# EAGLE design TSOC_Block_Template_Dual_SMD (EAGLE 6.6.0)
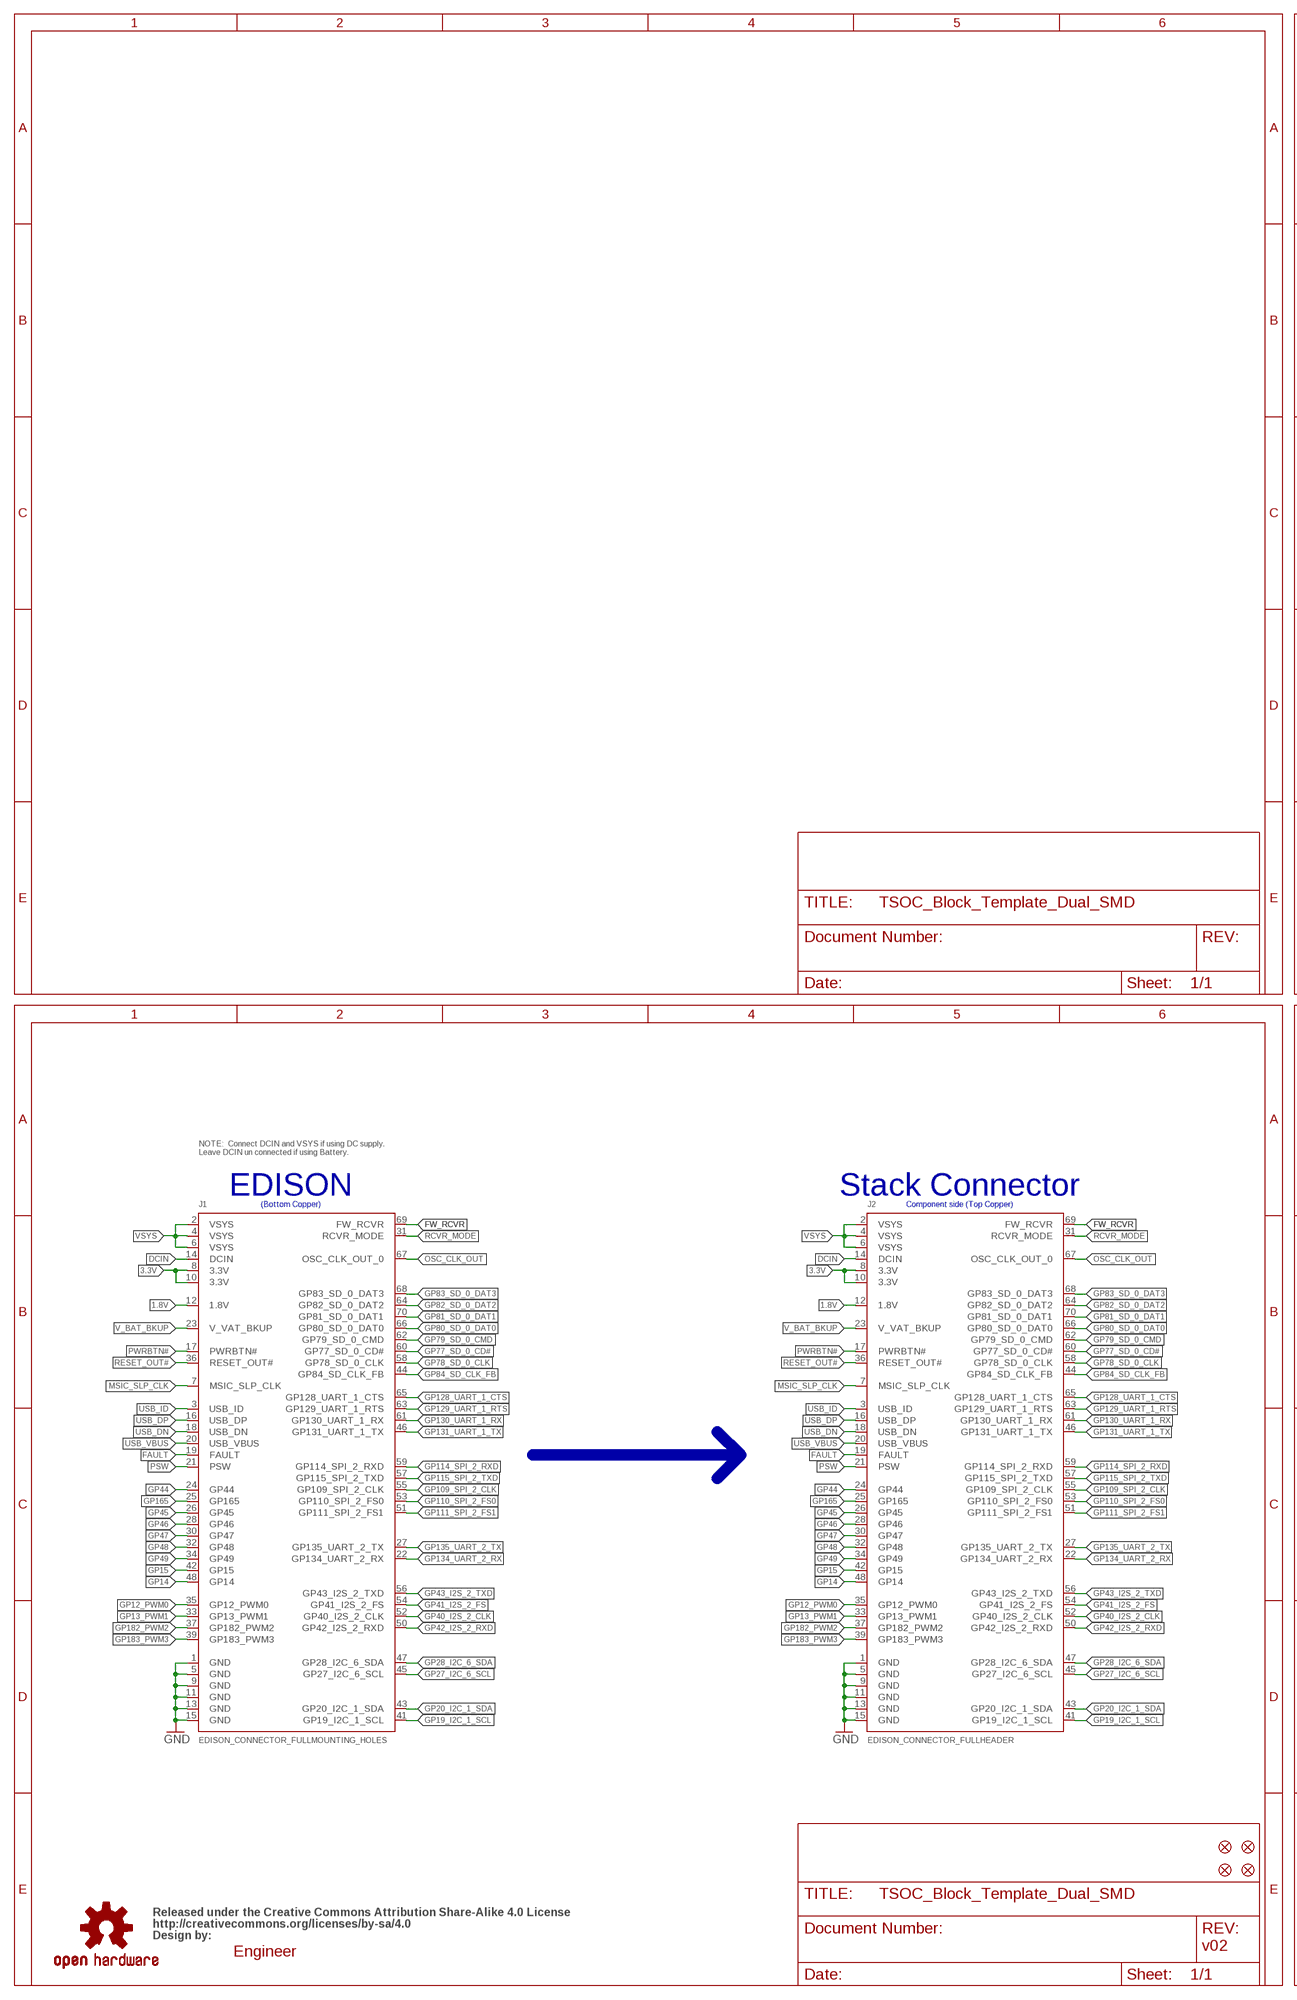
[diagram p0: schematic, sheet 1, part 1 of 2]
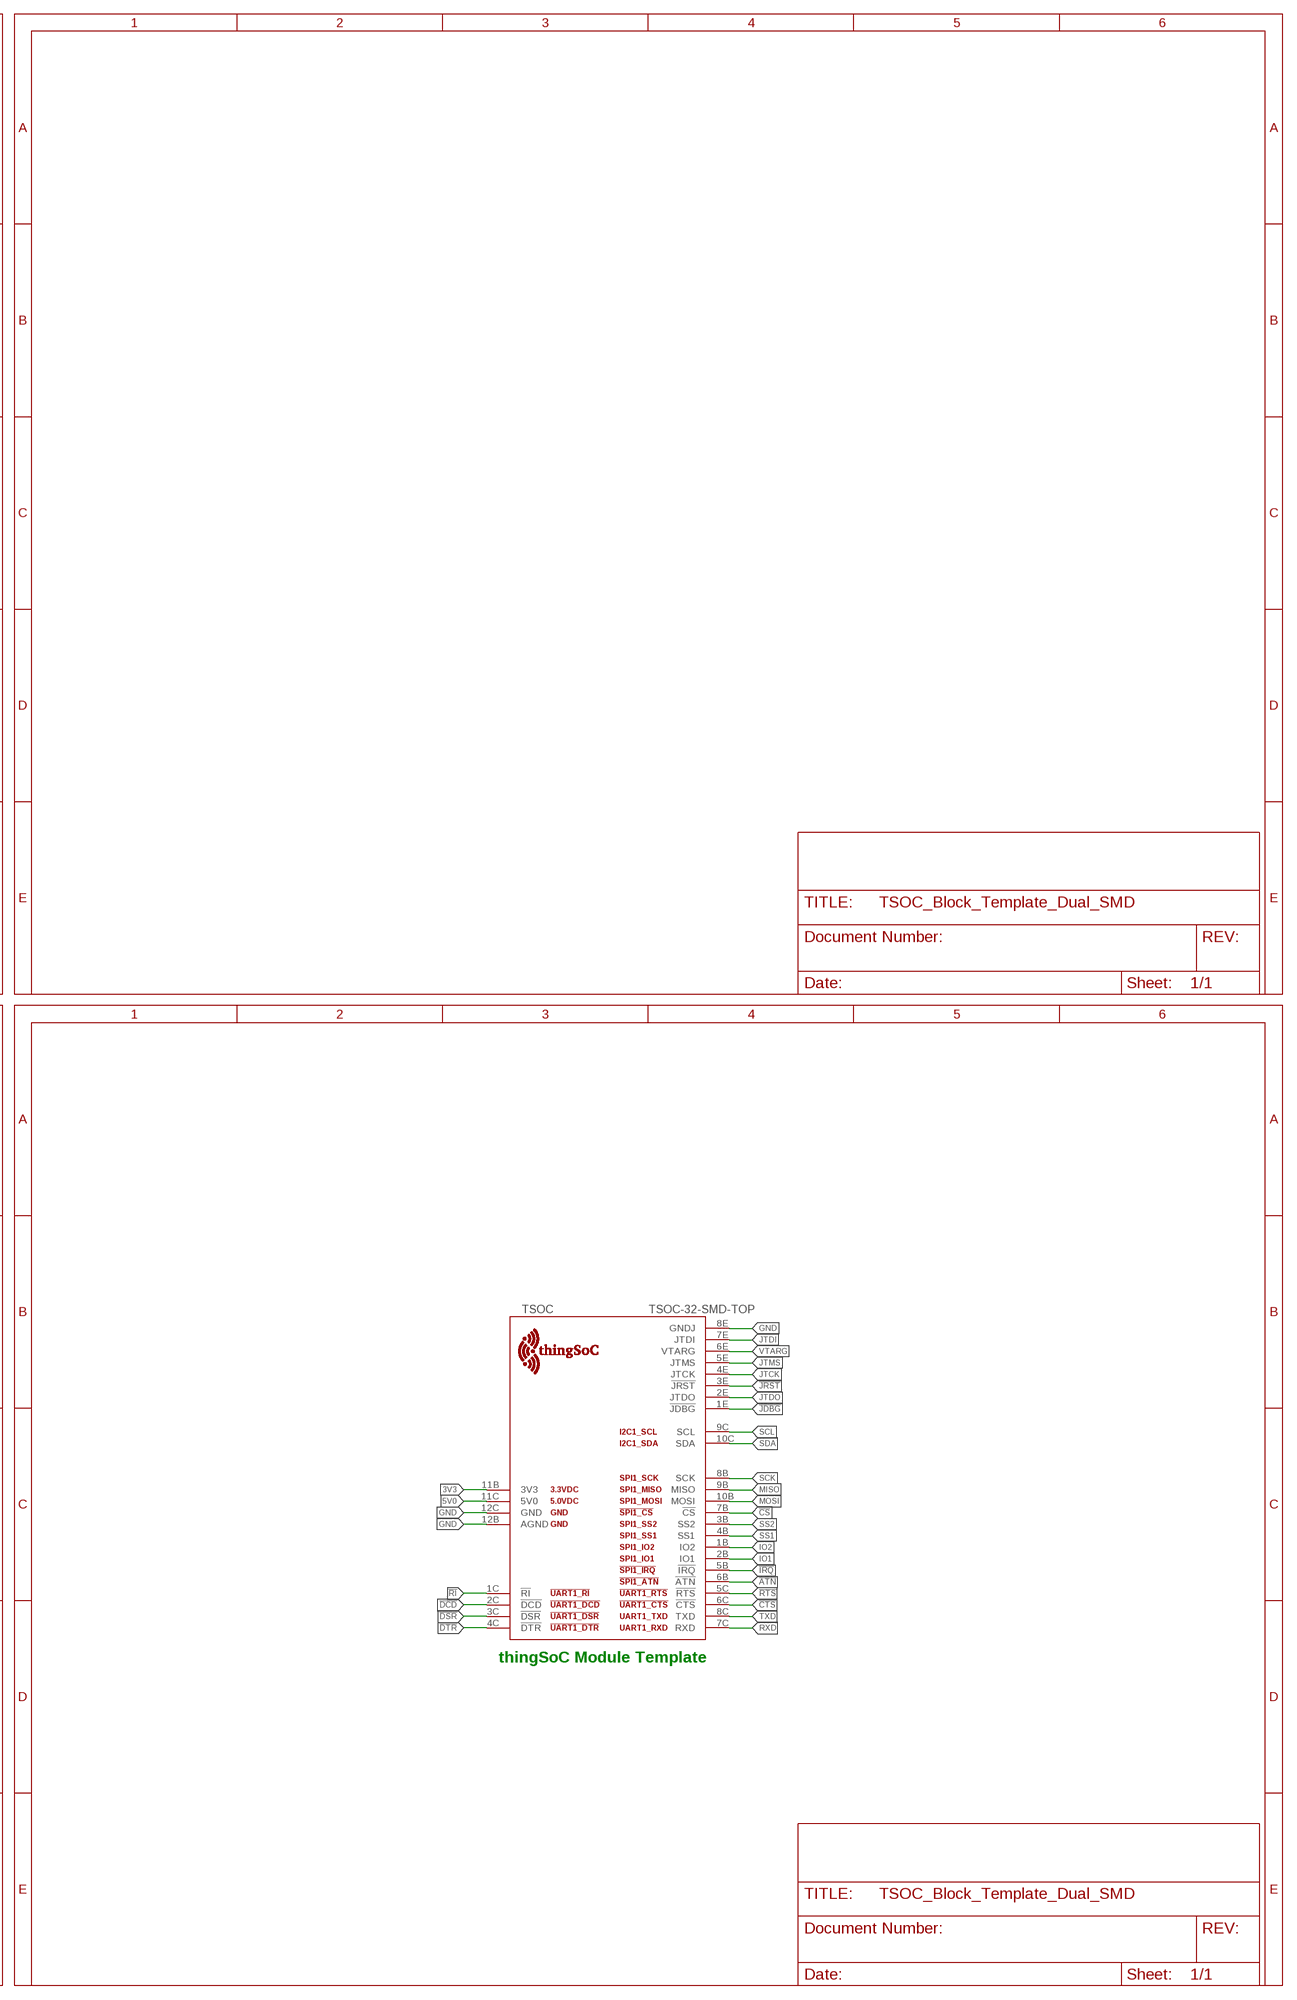
[diagram p1: schematic, sheet 1, part 2 of 2]

## Parts
FID5  FIDUCIAL1X2  [FIDUCIAL-1X2]
FID6  FIDUCIAL1X2  [FIDUCIAL-1X2]
FID7  FIDUCIAL1X2  [FIDUCIAL-1X2]
FID8  FIDUCIAL1X2  [FIDUCIAL-1X2]
J1  EDISON_CONNECTOR_FULLMOUNTING_HOLES  [EDISON_DAUGHTER]
J2  EDISON_CONNECTOR_FULLHEADER  [DF40C-70DP-0.4(51)]
LOGO5  OSHW-LOGOS  [OSHW-LOGO-S]
TSOC  TSOC-32-SMD-TOP  [TSOC-BB-S32-SMD-TOP]
U$1  BY_CC_SA_TEXTTEXT  [BY_CC_SA_TEXT]

## Nets
1.8V: J1.12(1.8V) J2.12(1.8V)
3.3V: J1.8(3.3V) J1.10(3.3V) J2.8(3.3V) J2.10(3.3V)
3V3: TSOC.11B(3V3)
5V0: TSOC.11C(5V0)
!ATN: TSOC.6B(!ATN)
!CS: TSOC.7B(!CS)
!CTS: TSOC.6C(!CTS)
!DCD: TSOC.2C(!DCD)
!DSR: TSOC.3C(!DSR)
!DTR: TSOC.4C(!DTR)
!IRQ: TSOC.5B(!IRQ)
!JDBG: TSOC.1E(!JDBG)
!JRST: TSOC.3E(!JRST)
!RI: TSOC.1C(!RI)
!RTS: TSOC.5C(!RTS)
DCIN: J1.14(DCIN) J2.14(DCIN)
FAULT: J1.19(FAULT) J2.19(FAULT)
FW_RCVR: J1.69(FW_RCVR) J2.69(FW_RCVR)
GND: J1.1(GND) J1.5(GND) J1.9(GND) J1.11(GND) J1.13(GND) J1.15(GND) J2.1(GND) J2.5(GND) J2.9(GND) J2.11(GND) J2.13(GND) J2.15(GND) TSOC.8E(GNDJ) TSOC.12B(AGND) TSOC.12C(GND)
GP12_PWM0: J1.35(GP12_PWM0) J2.35(GP12_PWM0)
GP13_PWM1: J1.33(GP13_PWM1) J2.33(GP13_PWM1)
GP14: J1.48(GP14) J2.48(GP14)
GP15: J1.42(GP15) J2.42(GP15)
GP19_I2C_1_SCL: J1.41(GP19_I2C_1_SCL) J2.41(GP19_I2C_1_SCL)
GP20_I2C_1_SDA: J1.43(GP20_I2C_1_SDA) J2.43(GP20_I2C_1_SDA)
GP27_I2C_6_SCL: J1.45(GP27_I2C_6_SCL) J2.45(GP27_I2C_6_SCL)
GP28_I2C_6_SDA: J1.47(GP28_I2C_6_SDA) J2.47(GP28_I2C_6_SDA)
GP40_I2S_2_CLK: J1.52(GP40_I2S_2_CLK) J2.52(GP40_I2S_2_CLK)
GP41_I2S_2_FS: J1.54(GP41_I2S_2_FS) J2.54(GP41_I2S_2_FS)
GP42_I2S_2_RXD: J1.50(GP42_I2S_2_RXD) J2.50(GP42_I2S_2_RXD)
GP43_I2S_2_TXD: J1.56(GP43_I2S_2_TXD) J2.56(GP43_I2S_2_TXD)
GP44: J1.24(GP44) J2.24(GP44)
GP45: J1.26(GP45) J2.26(GP45)
GP46: J1.28(GP46) J2.28(GP46)
GP47: J1.30(GP47) J2.30(GP47)
GP48: J1.32(GP48) J2.32(GP48)
GP49: J1.34(GP49) J2.34(GP49)
GP77_SD_0_CD#: J1.60(GP77_SD_0_CD#) J2.60(GP77_SD_0_CD#)
GP78_SD_0_CLK: J1.58(GP78_SD_0_CLK) J2.58(GP78_SD_0_CLK)
GP79_SD_0_CMD: J1.62(GP79_SD_0_CMD) J2.62(GP79_SD_0_CMD)
GP80_SD_0_DAT0: J1.66(GP80_SD_0_DAT0) J2.66(GP80_SD_0_DAT0)
GP81_SD_0_DAT1: J1.70(GP81_SD_0_DAT1) J2.70(GP81_SD_0_DAT1)
GP82_SD_0_DAT2: J1.64(GP82_SD_0_DAT2) J2.64(GP82_SD_0_DAT2)
GP83_SD_0_DAT3: J1.68(GP83_SD_0_DAT3) J2.68(GP83_SD_0_DAT3)
GP84_SD_CLK_FB: J1.44(GP84_SD_CLK_FB) J2.44(GP84_SD_CLK_FB)
GP109_SPI_2_CLK: J1.55(GP109_SPI_2_CLK) J2.55(GP109_SPI_2_CLK)
GP110_SPI_2_FS0: J1.53(GP110_SPI_2_FS0) J2.53(GP110_SPI_2_FS0)
GP111_SPI_2_FS1: J1.51(GP111_SPI_2_FS1) J2.51(GP111_SPI_2_FS1)
GP114_SPI_2_RXD: J1.59(GP114_SPI_2_RXD) J2.59(GP114_SPI_2_RXD)
GP115_SPI_2_TXD: J1.57(GP115_SPI_2_TXD) J2.57(GP115_SPI_2_TXD)
GP128_UART_1_CTS: J1.65(GP128_UART_1_CTS) J2.65(GP128_UART_1_CTS)
GP129_UART_1_RTS: J1.63(GP129_UART_1_RTS) J2.63(GP129_UART_1_RTS)
GP130_UART_1_RX: J1.61(GP130_UART_1_RX) J2.61(GP130_UART_1_RX)
GP131_UART_1_TX: J1.46(GP131_UART_1_TX) J2.46(GP131_UART_1_TX)
GP134_UART_2_RX: J1.22(GP134_UART_2_RX) J2.22(GP134_UART_2_RX)
GP135_UART_2_TX: J1.27(GP135_UART_2_TX) J2.27(GP135_UART_2_TX)
GP165: J1.25(GP165) J2.25(GP165)
GP182_PWM2: J1.37(GP182_PWM2) J2.37(GP182_PWM2)
GP183_PWM3: J1.39(GP183_PWM3) J2.39(GP183_PWM3)
IO1: TSOC.2B(IO1)
IO2: TSOC.1B(IO2)
JTCK: TSOC.4E(JTCK)
JTDI: TSOC.7E(JTDI)
JTDO: TSOC.2E(JTDO)
JTMS: TSOC.5E(JTMS)
MISO: TSOC.9B(MISO)
MOSI: TSOC.10B(MOSI)
MSIC_SLP_CLK: J1.7(MSIC_SLP_CLK) J2.7(MSIC_SLP_CLK)
OSC_CLK_OUT: J1.67(OSC_CLK_OUT_0) J2.67(OSC_CLK_OUT_0)
PSW: J1.21(PSW) J2.21(PSW)
PWRBTN#: J1.17(PWRBTN#) J2.17(PWRBTN#)
RCVR_MODE: J1.31(RCVR_MODE) J2.31(RCVR_MODE)
RESET_OUT#: J1.36(RESET_OUT#) J2.36(RESET_OUT#)
RXD: TSOC.7C(RXD)
SCK: TSOC.8B(SCK)
SCL: TSOC.9C(SCL)
SDA: TSOC.10C(SDA)
SS1: TSOC.4B(SS1)
SS2: TSOC.3B(SS2)
TXD: TSOC.8C(TXD)
USB_DN: J1.18(USB_DN) J2.18(USB_DN)
USB_DP: J1.16(USB_DP) J2.16(USB_DP)
USB_ID: J1.3(USB_ID) J2.3(USB_ID)
USB_VBUS: J1.20(USB_VBUS) J2.20(USB_VBUS)
V_BAT_BKUP: J1.23(V_VAT_BKUP) J2.23(V_VAT_BKUP)
VSYS: J1.2(VSYS) J1.4(VSYS) J1.6(VSYS) J2.2(VSYS) J2.4(VSYS) J2.6(VSYS)
VTARG: TSOC.6E(VTARG)

## Buses
B$1

## Notes on the sheet
- NOTE:  Connect DCIN and VSYS if using DC supply.
  Leave DCIN un connected if using Battery.
- EDISON | Stack Connector
- (Bottom Copper) | Component side (Top Copper)
- thingSoC Module Template
- Engineer
- v02

## Library data of the parts
FID5-FID8 = SparkFun-Aesthetics:FIDUCIAL: Fiducial Alignment Points Various fiducial points for machine vision alignment.
J1 J2 = Edison:EDISON_CONNECTOR_FULL
LOGO5 = SparkFun-Aesthetics:OSHW-LOGO: Open Source Hardware Logo This logo indicates the piece of hardware it is found on incorporates a OSHW license and/or adheres to the definition of open source hardware found here: http://freedomdefined.org/OSHW
TSOC = thingSoC:TSOC-32: thingSoC Thirty-Two (32) Pin Socket Source LBR : http://www.thingsoc.com Github : https://github.com/thingsoc License : http://creativecommons.org/licenses/by-sa/4.0/ (Creative Commons 4.0) THIS SOFTWARE IS PROVIDED BY THE CONTRIBUTORS "AS IS" AND WITHOUT ANY EXPRESS OR IMPLIED WARRANTIES, INCLUDING, BUT NOT LIMITED TO, THE IMPLIED WARRANTIES OF MERCHANTABILITY AND FITNESS FOR A PARTICULAR PURPOSE ARE DISCLAIMED. IN NO EVENT SHALL THE COPYRIGHT OWNER OR CONTRIBUTORS BE LIABLE FOR ANY DIRECT, INDIRECT, INCIDENTAL, SPECIAL, EXEMPLARY, OR CONSEQUENTIAL DAMAGES (INCLUDING, BUT NOT LIMITED TO, PROCUREMENT OF SUBSTITUTE GOODS OR SERVICES; LOSS OF USE, DATA, OR PROFITS; OR BUSINESS INTERRUPTION) HOWEVER CAUSED AND ON ANY THEORY OF LIABILITY, WHETHER IN CONTRACT, STRICT LIABILITY, OR TORT (INCLUDING NEGLIGENCE OR OTHERWISE) ARISING IN ANY WAY OUT OF THE USE OF THIS SOFTWARE, EVEN IF ADVISED OF THE POSSIBILITY OF SUCH DAMAGE.
U$1 = PatternAgents-Logos:BY_CC_SA_TEXT: BY_CC_SA_TEXT Source : http://wiki.creativecommons.org/CC_markers Github : https://github.com/PatternAgents/PCB_Libraries License : http://creativecommons.org/licenses/by-sa/4.0/ (Creative Commons 4.0) THIS SOFTWARE IS PROVIDED BY THE CONTRIBUTORS "AS IS" AND WITHOUT ANY EXPRESS OR IMPLIED WARRANTIES, INCLUDING, BUT NOT LIMITED TO, THE IMPLIED WARRANTIES OF MERCHANTABILITY AND FITNESS FOR A PARTICULAR PURPOSE ARE DISCLAIMED. IN NO EVENT SHALL THE COPYRIGHT OWNER OR CONTRIBUTORS BE LIABLE FOR ANY DIRECT, INDIRECT, INCIDENTAL, SPECIAL, EXEMPLARY, OR CONSEQUENTIAL DAMAGES (INCLUDING, BUT NOT LIMITED TO, PROCUREMENT OF SUBSTITUTE GOODS OR SERVICES; LOSS OF USE, DATA, OR PROFITS; OR BUSINESS INTERRUPTION) HOWEVER CAUSED AND ON ANY THEORY OF LIABILITY, WHETHER IN CONTRACT, STRICT LIABILITY, OR TORT (INCLUDING NEGLIGENCE OR OTHERWISE) ARISING IN ANY WAY OUT OF THE USE OF THIS SOFTWARE, EVEN IF ADVISED OF THE POSSIBILITY OF SUCH DAMAGE.

## Net classes
1 vcc: width 0.254 mm

## Board
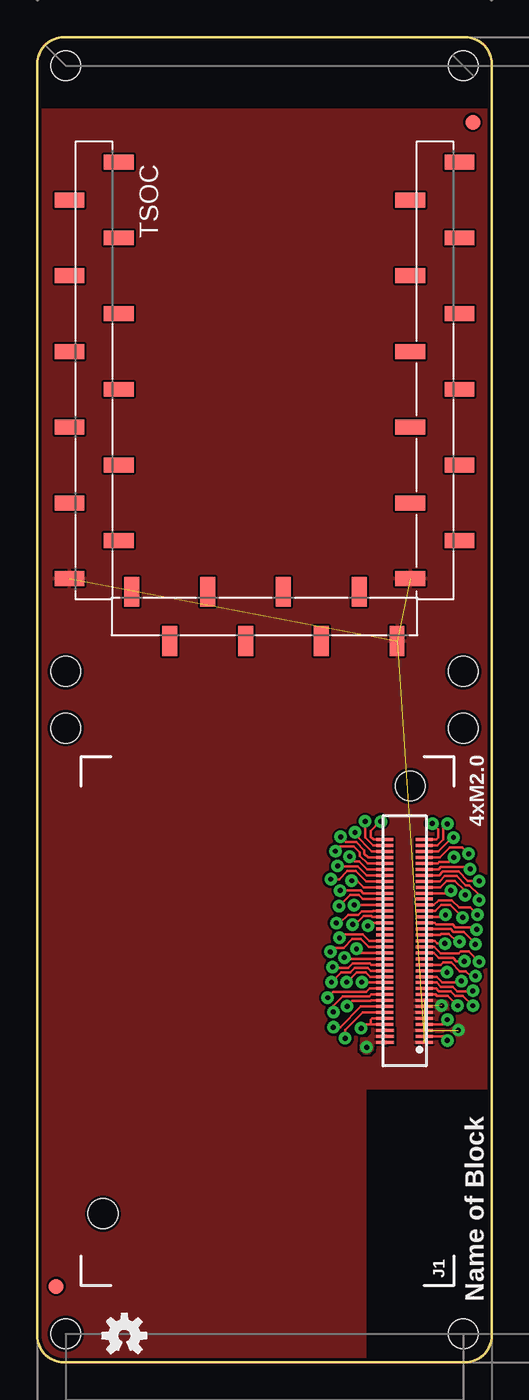
[diagram p2: board, top side]
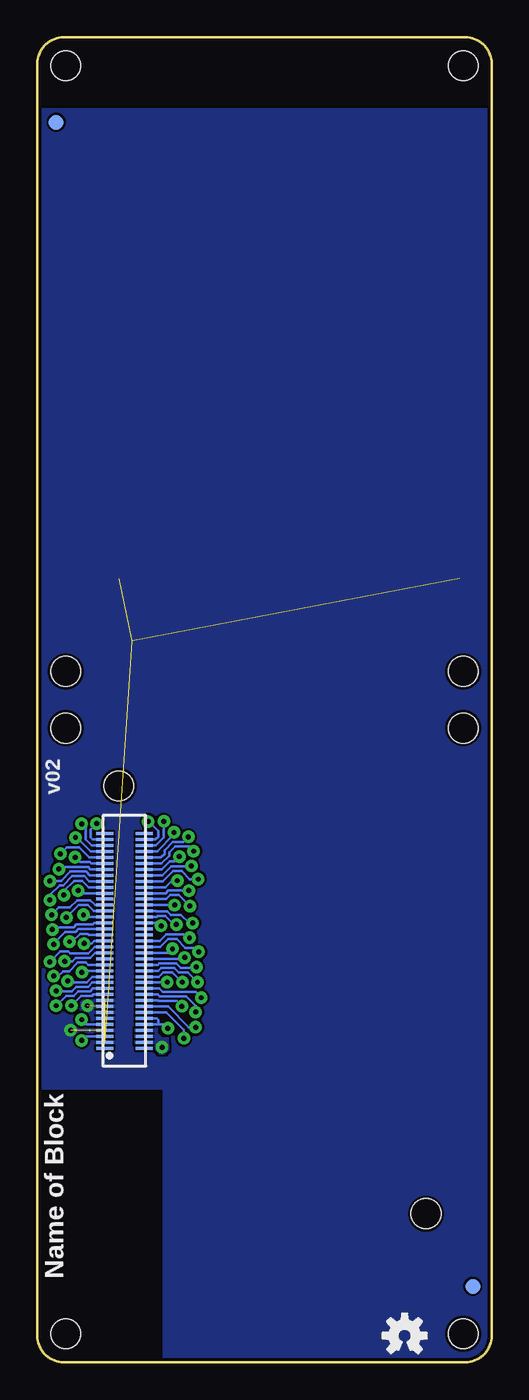
[diagram p3: board, bottom side, seen from below]

Size 30.48 x 88.9 mm. Coordinates in mm from the lower left corner, seen from the top.
Outline: 30.48,1.78 30.48,87.12 arc90 28.7,88.9 1.78,88.9 arc90 0,87.12 0,1.78 arc90 1.78,0 28.7,0 arc90 30.48,1.78
Copper layers (1*16): Top 0.035mm / dielectric 1.5mm / Bottom 0.035mm
Design rules "SparkFun-2-layer *": minimum track width 6mil, minimum drill 13mil, track to track 6mil, track to pad 6mil, pad to pad 6mil, via to via 6mil, smd to smd 6mil, copper to edge 8mil, drill to drill 8mil, minimum pad ring 12mil, minimum via ring 10mil, stop-mask expansion 4mil, vias tented up to drill 20mil, thermal gap 6mil
Holes 2 mm at 28.57,87 1.91,87 1.91,1.91 28.57,1.91 1.91,42.55 28.57,42.55 1.91,46.35 28.57,46.35
tRestrict: area 22.1,0 to 30.5,18.3; area 0,84.3 to 30.5,88.9
bRestrict: area 22.1,0 to 30.5,18.3; area 0,84.3 to 30.5,88.9

### Footprints (pad centres in the part's own frame; a part is rotated, then mirrored left to right if it is on the bottom)
FIDUCIAL-1X2 = smd 1 x 1: 1 0,0
EDISON_DAUGHTER = smd 1.14 x 0.2: 1 1.98,19.17; 2 4.62,19.17; 3 1.98,18.77; 4 4.62,18.77; 5 1.98,18.37; 6 4.62,18.37; 7 1.98,17.97; 8 4.62,17.97; 9 1.98,17.57; 10 4.62,17.57; 11 1.98,17.17; 12 4.62,17.17; 13 1.98,16.77; 14 4.62,16.77; 15 1.98,16.37; 16 4.62,16.37; 17 1.98,15.97; 18 4.62,15.97; 19 1.98,15.57; 20 4.62,15.57; 21 1.98,15.17; 22 4.62,15.17; 23 1.98,14.77; 24 4.62,14.77; 25 1.98,14.37; 26 4.62,14.37; 27 1.98,13.97; 28 4.62,13.97; 29 1.98,13.57; 30 4.62,13.57; 31 1.98,13.17; 32 4.62,13.17; 33 1.98,12.77; 34 4.62,12.77; 35 1.98,12.37; 36 4.62,12.37; 37 1.98,11.97; 38 4.62,11.97; 39 1.98,11.57; 40 4.62,11.57; 41 1.98,11.17; 42 4.62,11.17; 43 1.98,10.77; 44 4.62,10.77; 45 1.98,10.37; 46 4.62,10.37; 47 1.98,9.97; 48 4.62,9.97; 49 1.98,9.57; 50 4.62,9.57; 51 1.98,9.17; 52 4.62,9.17; 53 1.98,8.77; 54 4.62,8.77; 55 1.98,8.37; 56 4.62,8.37; 57 1.98,7.97; 58 4.62,7.97; 59 1.98,7.57; 60 4.62,7.57; 61 1.98,7.17; 62 4.62,7.17; 63 1.98,6.77; 64 4.62,6.77; 65 1.98,6.37; 66 4.62,6.37; 67 1.98,5.97; 68 4.62,5.97; 69 1.98,5.57; 70 4.62,5.57 | hole 2: 23.53,30.67; 2.93,1.98
DF40C-70DP-0.4(51) = smd 0.2 x 1.14 bottom: 1 6.8,1.32; 2 6.8,-1.32; 3 6.4,1.32; 4 6.4,-1.32; 5 6,1.32; 6 6,-1.32; 7 5.6,1.32; 8 5.6,-1.32; 9 5.2,1.32; 10 5.2,-1.32; 11 4.8,1.32; 12 4.8,-1.32; 13 4.4,1.32; 14 4.4,-1.32; 15 4,1.32; 16 4,-1.32; 17 3.6,1.32; 18 3.6,-1.32; 19 3.2,1.32; 20 3.2,-1.32; 21 2.8,1.32; 22 2.8,-1.32; 23 2.4,1.32; 24 2.4,-1.32; 25 2,1.32; 26 2,-1.32; 27 1.6,1.32; 28 1.6,-1.32; 29 1.2,1.32; 30 1.2,-1.32; 31 0.8,1.32; 32 0.8,-1.32; 33 0.4,1.32; 34 0.4,-1.32; 35 0,1.32; 36 0,-1.32; 37 -0.4,1.32; 38 -0.4,-1.32; 39 -0.8,1.32; 40 -0.8,-1.32; 41 -1.2,1.32; 42 -1.2,-1.32; 43 -1.6,1.32; 44 -1.6,-1.32; 45 -2,1.32; 46 -2,-1.32; 47 -2.4,1.32; 48 -2.4,-1.32; 49 -2.8,1.32; 50 -2.8,-1.32; 51 -3.2,1.32; 52 -3.2,-1.32; 53 -3.6,1.32; 54 -3.6,-1.32; 55 -4,1.32; 56 -4,-1.32; 57 -4.4,1.32; 58 -4.4,-1.32; 59 -4.8,1.32; 60 -4.8,-1.32; 61 -5.2,1.32; 62 -5.2,-1.32; 63 -5.6,1.32; 64 -5.6,-1.32; 65 -6,1.32; 66 -6,-1.32; 67 -6.4,1.32; 68 -6.4,-1.32; 69 -6.8,1.32; 70 -6.8,-1.32; NC1 7.2,1.32; NC2 7.2,-1.32; NC3 -7.2,-1.32; NC4 -7.2,1.32
TSOC-BB-S32-SMD-TOP = smd 1 x 2: 1B -11.43,-9.78; 1C -11.43,13.08; 2B -8.89,-13.08; 2C -8.89,9.78; 3B -6.35,-9.78; 3C -6.35,13.08; 4B -3.81,-13.08; 4C -3.81,9.78; 5B -1.27,-9.78; 5C -1.27,13.08; 6B 1.27,-13.08; 6C 1.27,9.78; 7B 3.81,-9.78; 7C 3.81,13.08; 8B 6.35,-13.08; 8C 6.35,9.78; 9B 8.89,-9.78; 9C 8.89,13.08; 10B 11.43,-13.08; 10C 11.43,9.78; 11B 13.97,-9.78; 11C 13.97,13.08; 12B 16.51,-13.08; 12C 16.51,9.78 | smd 2 x 1: 1E 17.4,-8.89; 2E 20.7,-6.35; 3E 17.4,-3.81; 4E 20.7,-1.27; 5E 17.4,1.27; 6E 20.7,3.81; 7E 17.4,6.35; 8E 20.7,8.89

### Placement (x,y rotation side)
FID5  1.27,5.08 0 bottom
FID6  1.27,5.08 0 top
FID7  29.21,83.19 0 bottom
FID8  29.21,83.19 0 top
J1  27.94,40.64 180 top
J2  24.64,28.27 270 top
LOGO2  OSHW-LOGOS  [OSHW-LOGO-S]  5.84,1.78 0 top
LOGO5  5.84,1.78 0 bottom
TSOC  15.24,69.09 270 top
U$1  -11.94,-15.75 0 top  (outside the outline)

### Tracks (layer width: path | path; a pad name or v marks a point on that pad's centre or on a via)
1.8V  (via drill 0.33)
  Top 0.152: v20.65,21.74 20.65,22.3 21.82,23.47 J2.12 | J2.12
  Bottom 0.152: J2.12 21.82,23.47 20.65,22.3 v20.65,21.74
3.3V  (via drill 0.33)
  Top 0.152: J2.8 22.38,22.67 | 22.38,22.67 21.98,22.67 v21.72,22.4 | J2.10 22.46,23.07 22.38,22.99 22.38,22.67
  Bottom 0.152: J2.8 | v21.72,22.4 21.98,22.67 22.38,22.67 | 22.38,22.67 J2.8 | J2.10 22.46,23.07 22.38,22.99 22.38,22.67
DCIN  (via drill 0.33)
  Top 0.152: v19.86,22.48 20.32,22.48 21.71,23.87 J2.14
  Bottom 0.152: J2.14 21.8,23.87 | v19.86,22.48 20.32,22.48 21.71,23.87 21.8,23.87 | 21.8,23.87
FAULT  (via drill 0.33)
  Top 0.152: v29.21,23.93 28.55,24.59 28.04,24.59 27.74,24.89 26.92,24.89 26.75,25.07 J2.19
  Bottom 0.152: J2.19 26.75,25.07 26.92,24.89 27.74,24.89 28.04,24.59 28.55,24.59 v29.21,23.93
FW_RCVR  (via drill 0.33)
  Top 0.152: J2.69 26.76,35.07 26.9,35.2 26.9,35.74 v26.49,36.14
  Bottom 0.152: v26.49,36.14 26.9,35.74 26.9,35.2 26.76,35.07 J2.69
GND  (via drill 0.33)  (17 unrouted)
  Bottom 0.152: 26.94,22.27 26.95,22.28
  other vias: 28.24,22.28 27.13,23.93
  pour Top (rank 6): 30.48,1.78 30.48,87.12 arc90 28.7,88.9 1.78,88.9 arc90 0,87.12 0,1.78 arc90 1.78,0 28.7,0 arc90
  pour Bottom (rank 6): 30.48,87.12 arc90 28.75,88.9 1.78,88.9 arc90 0,87.12 0,1.78 arc90 1.78,0 28.7,0 arc90 30.48,1.78
GP12_PWM0  (via drill 0.33)
  Top 0.152: v27.33,28.09 26.82,28.09 26.64,28.27 J2.35 | J2.35
  Bottom 0.152: J2.35 26.64,28.27 26.82,28.09 v27.33,28.09
GP13_PWM1  (via drill 0.33)
  Top 0.152: J2.33 26.61,27.87 27.05,27.43 28.27,27.43 28.4,27.56 28.93,27.56 29.62,26.87 v29.64,26.87
  Bottom 0.152: v29.64,26.87 29.62,26.87 28.93,27.56 28.4,27.56 28.27,27.43 27.05,27.43 26.61,27.87 J2.33
GP14  (via drill 0.33)
  Top 0.152: J2.48 21.27,30.67 v21.26,30.68
  Bottom 0.152: v21.26,30.68 21.27,30.67 J2.48
GP15  (via drill 0.33)
  Top 0.152: v22.17,29.29 22.36,29.47 J2.42
  Bottom 0.152: J2.42 22.36,29.47 v22.17,29.29
GP19_I2C_1_SCL  (via drill 0.33)
  Top 0.152: v29.46,29.03 29.31,29.18 28.04,29.18 27.86,29.36 26.77,29.36 26.66,29.47 J2.41
  Bottom 0.152: J2.41 26.66,29.47 26.77,29.36 27.86,29.36 28.04,29.18 29.31,29.18 v29.46,29.03
GP20_I2C_1_SDA  (via drill 0.33)
  Top 0.152: v27.38,30.02 27.23,29.87 J2.43 | J2.43
  Bottom 0.152: J2.43 27.23,29.87 v27.38,30.02
GP27_I2C_6_SCL  (via drill 0.33)
  Top 0.152: J2.45 26.69,30.27 27.1,30.68 27.69,30.68 v28.52,29.84
  Bottom 0.152: v28.52,29.84 27.69,30.68 27.1,30.68 26.69,30.27 J2.45
GP28_I2C_6_SDA  (via drill 0.33)
  Top 0.152: v29.52,30.02 29.03,30.5 28.3,30.5 27.81,30.99 26.92,30.99 26.61,30.67 J2.47
  Bottom 0.152: J2.47 26.61,30.67 26.92,30.99 27.81,30.99 28.3,30.5 29.03,30.5 v29.52,30.02
GP40_I2S_2_CLK  (via drill 0.33)
  Top 0.152: v20.32,31.65 21.69,31.65 21.87,31.47 J2.52
  Bottom 0.152: J2.52 21.87,31.47 21.69,31.65 v20.32,31.65
GP41_I2S_2_FS  (via drill 0.33)
  Top 0.152: J2.54 21.9,31.87 21.46,32.31 v21.08,32.31
  Bottom 0.152: v21.08,32.31 21.46,32.31 21.9,31.87 J2.54
GP42_I2S_2_RXD  (via drill 0.33)
  Top 0.152: v20.24,30.61 20.98,31.34 21.57,31.34 21.84,31.07 J2.50
  Bottom 0.152: J2.50 21.84,31.07 21.57,31.34 20.98,31.34 v20.24,30.61
GP43_I2S_2_TXD  (via drill 0.33)
  Top 0.152: v19.68,32.41 20.24,32.41 20.8,32.97 21.36,32.97 22.06,32.27 J2.56
  Bottom 0.152: J2.56 22.06,32.27 21.36,32.97 20.8,32.97 20.24,32.41 v19.68,32.41
GP44  (via drill 0.33)
  Top 0.152: v20.75,25.5 21.41,26.16 22.05,26.16 22.34,25.87 J2.24
  Bottom 0.152: J2.24 22.34,25.87 22.05,26.16 21.41,26.16 v20.75,25.5
GP45  (via drill 0.33)
  Top 0.152: J2.26 22.37,26.27 22.17,26.47 21.29,26.47 20.98,26.16 20.4,26.16 v19.74,25.5
  Bottom 0.152: v19.74,25.5 20.4,26.16 20.98,26.16 21.29,26.47 22.17,26.47 22.37,26.27 J2.26
GP46  (via drill 0.33)
  Top 0.152: v19.81,26.52 19.86,26.47 20.85,26.47 21.16,26.77 22.3,26.77 22.4,26.67 J2.28
  Bottom 0.152: J2.28 22.4,26.67 22.3,26.77 21.16,26.77 20.85,26.47 19.86,26.47 v19.81,26.52
GP47  (via drill 0.33)
  Top 0.152: v20.6,27.15 20.68,27.08 22.43,27.08 22.43,27.07 J2.30
  Bottom 0.152: J2.30 22.43,27.07 22.43,27.08 20.68,27.08 v20.6,27.15
GP48  (via drill 0.33)
  Top 0.152: J2.32 21.68,27.47 v21.41,27.74
  Bottom 0.152: v21.41,27.74 21.68,27.47 J2.32
GP49  (via drill 0.33)
  Top 0.152: v19.66,27.53 19.94,27.81 20.55,27.81 21.13,28.4 21.69,28.4 22.22,27.87 J2.34
  Bottom 0.152: J2.34 22.22,27.87 21.69,28.4 21.13,28.4 20.55,27.81 19.94,27.81 v19.66,27.53
GP77_SD_0_CD#  (via drill 0.33)
  Top 0.152: v20.95,33.93 21.29,33.6 21.59,33.6 22.12,33.07 J2.60
  Bottom 0.152: J2.60 22.12,33.07 21.59,33.6 21.29,33.6 v20.95,33.93
GP78_SD_0_CLK  (via drill 0.33)
  Top 0.152: v20.14,33.3 20.17,33.27 21.49,33.27 22.09,32.67 J2.58
  Bottom 0.152: J2.58 22.09,32.67 21.49,33.27 20.17,33.27 v20.14,33.3
GP79_SD_0_CMD  (via drill 0.33)
  Top 0.152: v19.99,34.29 20.3,34.59 21.23,34.59 21.64,34.19 21.64,33.98 22.16,33.47 J2.62
  Bottom 0.152: J2.62 22.16,33.47 21.64,33.98 21.64,34.19 21.23,34.59 20.3,34.59 v19.99,34.29
GP80_SD_0_DAT0  (via drill 0.33)
  Top 0.152: J2.66 22.45,34.27 21.31,35.41 v21.31,35.56
  Bottom 0.152: v21.31,35.56 21.31,35.41 22.45,34.27 J2.66
GP81_SD_0_DAT1  (via drill 0.33)
  Top 0.152: v23.04,36.27 22.99,36.27 22.38,35.66 22.38,35.26 22.56,35.07 J2.70
  Bottom 0.152: J2.70 22.56,35.07 22.38,35.26 22.38,35.66 22.99,36.27 v23.04,36.27
GP82_SD_0_DAT2  (via drill 0.33)
  Top 0.152: v20.34,35.26 20.7,34.9 21.39,34.9 21.95,34.34 21.95,34.11 22.19,33.87 J2.64
  Bottom 0.152: J2.64 22.19,33.87 21.95,34.11 21.95,34.34 21.39,34.9 20.7,34.9 v20.34,35.26
GP83_SD_0_DAT3  (via drill 0.33)
  Top 0.152: J2.68 22.53,34.67 22,35.2 v22,36.3
  Bottom 0.152: v22,36.3 22,35.2 22.53,34.67 J2.68
GP84_SD_CLK_FB  (via drill 0.33)
  Top 0.152: v21.16,29.36 21.31,29.36 21.89,29.95 22.4,29.95 22.48,29.87 J2.44 | J2.44
  Bottom 0.152: J2.44 22.48,29.87 22.4,29.95 21.89,29.95 21.31,29.36 v21.16,29.36
GP109_SPI_2_CLK  (via drill 0.33)
  Top 0.152: v29.64,31.01 29.64,31.34 28.98,32 28.75,32 28.14,32.61 27.33,32.61 26.99,32.27 J2.55
  Bottom 0.152: J2.55 26.99,32.27 27.33,32.61 28.14,32.61 28.75,32 28.98,32 29.64,31.34 v29.64,31.01
GP110_SPI_2_FS0  (via drill 0.33)
  Top 0.152: J2.53 27.02,31.87 27.46,32.31 28.02,32.31 28.7,31.62 v28.7,31.34
  Bottom 0.152: v28.7,31.34 28.7,31.62 28.02,32.31 27.46,32.31 27.02,31.87 J2.53
GP111_SPI_2_FS1  (via drill 0.33)
  Top 0.152: J2.51 27.56,31.47 v27.74,31.65
  Bottom 0.152: v27.74,31.65 27.56,31.47 J2.51
GP114_SPI_2_RXD  (via drill 0.33)
  Top 0.152: J2.59 26.92,33.07 27.08,33.22 28.91,33.22 v29.03,33.1
  Bottom 0.152: J2.59 26.92,33.07 27.08,33.22 28.91,33.22 v29.03,33.1
GP115_SPI_2_TXD  (via drill 0.33)
  Top 0.152: J2.57 26.95,32.67 27.2,32.92 28.27,32.92 28.88,32.31 29.62,32.31 v29.64,32.28
  Bottom 0.152: J2.57 26.95,32.67 27.2,32.92 28.27,32.92 28.88,32.31 29.62,32.31 v29.64,32.28
GP128_UART_1_CTS  (via drill 0.33)
  Top 0.152: v27.91,35.2 27.84,35.2 26.9,34.27 J2.65
  Bottom 0.152: J2.65 26.9,34.27 27.84,35.2 v27.91,35.2
GP129_UART_1_RTS  (via drill 0.33)
  Top 0.152: J2.63 26.99,33.87 27.66,34.54 28.5,34.54 v28.93,34.11
  Bottom 0.152: v28.93,34.11 28.5,34.54 27.66,34.54 26.99,33.87 J2.63
GP130_UART_1_RX  (via drill 0.33)
  Top 0.152: J2.61 26.87,33.47 26.95,33.55 27.61,33.55 v27.94,33.88
  Bottom 0.152: v27.94,33.88 27.61,33.55 26.95,33.55 26.87,33.47 J2.61
GP131_UART_1_TX  (via drill 0.33)
  Top 0.152: v20.07,29.46 20.3,29.46 20.85,30.02 21.54,30.02 21.77,30.25 22.5,30.25 22.52,30.27 J2.46
  Bottom 0.152: J2.46 22.52,30.27 22.5,30.25 21.77,30.25 21.54,30.02 20.85,30.02 20.3,29.46 v20.07,29.46
GP134_UART_2_RX  (via drill 0.33)
  Top 0.152: J2.22 21.8,25.47 v21.77,25.5
  Bottom 0.152: v21.77,25.5 21.8,25.47 J2.22
GP135_UART_2_TX  (via drill 0.33)
  Top 0.152: J2.27 27.08,26.67 27.23,26.82 27.76,26.82 28.35,26.24 28.73,26.24 29.06,25.91 v29.39,25.91
  Bottom 0.152: v29.39,25.91 29.06,25.91 28.73,26.24 28.35,26.24 27.76,26.82 27.23,26.82 27.08,26.67 J2.27
GP165  (via drill 0.33)
  Top 0.152: J2.25 27.38,26.27 v27.48,26.16
  Bottom 0.152: v27.48,26.16 27.38,26.27 J2.25
GP182_PWM2  (via drill 0.33)
  Top 0.152: v28.32,28.22 28.14,28.22 27.61,28.75 27.1,28.75 27.02,28.67 J2.37
  Bottom 0.152: J2.37 27.02,28.67 27.1,28.75 27.61,28.75 28.14,28.22 v28.32,28.22
GP183_PWM3  (via drill 0.33)
  Top 0.152: J2.39 26.61,29.07 26.62,29.06 27.74,29.06 27.91,28.88 28.6,28.88 29.39,28.09 v29.39,28.04
  Bottom 0.152: v29.39,28.04 29.39,28.09 28.6,28.88 27.91,28.88 27.74,29.06 26.62,29.06 26.61,29.07 J2.39
MSIC_SLP_CLK  (via drill 0.33)
  Top 0.152: J2.7 27.19,22.67 v27.51,22.99
  Bottom 0.152: v27.51,22.99 27.19,22.67 J2.7
OSC_CLK_OUT  (via drill 0.33)
  Top 0.152: J2.67 26.82,34.67 27.23,35.08 27.23,35.84 v27.51,36.12
  Bottom 0.152: v27.51,36.12 27.23,35.84 27.23,35.08 26.82,34.67 J2.67
PSW  (via drill 0.33)
  Top 0.152: J2.21 26.78,25.47 27.05,25.2 27.86,25.2 28.17,24.89 29.18,24.89 v29.21,24.92
  Bottom 0.152: v29.21,24.92 29.18,24.89 28.17,24.89 27.86,25.2 27.05,25.2 26.78,25.47 J2.21
PWRBTN#  (via drill 0.33)
  Top 0.152: J2.17 26.71,24.67 26.8,24.59 27.53,24.59 v28.19,23.93
  Bottom 0.152: v28.19,23.93 27.53,24.59 26.8,24.59 26.71,24.67 J2.17
RCVR_MODE  (via drill 0.33)
  Top 0.152: J2.31 26.58,27.47 26.92,27.13 27.89,27.13 28.12,26.9 v28.65,26.9
  Bottom 0.152: v28.65,26.9 28.12,26.9 27.89,27.13 26.92,27.13 26.58,27.47 J2.31
RESET_OUT#  (via drill 0.33)
  Top 0.152: v20.27,28.47 20.5,28.7 21.82,28.7 22.25,28.27 J2.36
  Bottom 0.152: J2.36 22.25,28.27 21.82,28.7 20.5,28.7 v20.27,28.47
USB_DN  (via drill 0.33)
  Top 0.152: v19.86,23.5 19.86,23.9 20.5,24.54 22.25,24.54 22.38,24.67 J2.18
  Bottom 0.152: J2.18 22.38,24.67 22.25,24.54 20.5,24.54 19.86,23.9 v19.86,23.5
USB_DP  (via drill 0.33)
  Top 0.152: v20.78,23.88 21.13,24.23 22.38,24.23 22.42,24.27 J2.16
  Bottom 0.152: J2.16 22.42,24.27 22.38,24.23 21.13,24.23 v20.78,23.88
USB_ID  (via drill 0.33)
  Top 0.152: J2.3 27.23,21.87 v27.51,21.59
  Bottom 0.152: v27.51,21.59 27.23,21.87 J2.3
USB_VBUS  (via drill 0.33)
  Top 0.152: J2.20 22.3,25.07 22.07,24.84 19.86,24.84 v19.48,24.46
  Bottom 0.152: v19.48,24.46 19.86,24.84 22.07,24.84 22.3,25.07 J2.20
V_BAT_BKUP  (via drill 0.33)
  Top 0.152: J2.23 26.81,25.87 27.18,25.5 28.37,25.5 v28.45,25.58
  Bottom 0.152: v28.45,25.58 28.37,25.5 27.18,25.5 26.81,25.87 J2.23
VSYS  (via drill 0.33)
  other vias: 22.1,21.13
  pour Top: 21.72,21.74 21.69,20.95 21.92,20.73 22.28,20.73 22.5,20.95 22.5,21.13 22.73,21.36 23.88,21.36 23.88,22.45 22.45,22.45 22.45,22.07 22.12,21.74
  pour Bottom: 21.72,21.74 21.69,20.95 21.92,20.73 22.28,20.73 22.5,20.95 22.5,21.13 22.73,21.36 23.88,21.36 23.88,22.45 22.45,22.45 22.45,22.07 22.12,21.74

### Text on the board
tPlace: 4xM2.0 | Name of Block
bPlace: v02 | Name of Block
tDocu: Max Board Length | User Interface/Connectors / RF/Antenna Safe Area | LEDs & User Switches/Buttons go here | Nothing goes here! / I mean it... | Note: Units are in Inches | Engineer